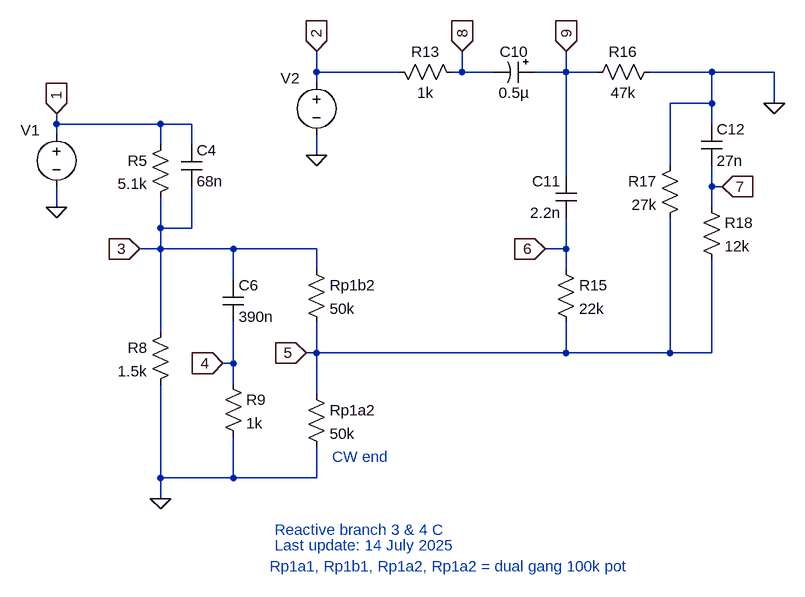
[diagram p0: schematic Reactive_branch_3&4_c.asc]
Reactive_branch_3&4_c.asc, the LTspice schematic file:
Version 4
SHEET 1 4496 5064
WIRE 32 2544 32 2512
WIRE 160 2544 32 2544
WIRE 256 2544 256 2512
WIRE 256 2544 240 2544
WIRE 304 2544 256 2544
WIRE 416 2544 416 2512
WIRE 416 2544 368 2544
WIRE 464 2544 416 2544
WIRE 640 2544 544 2544
WIRE 736 2544 640 2544
WIRE 32 2560 32 2544
WIRE 640 2592 640 2544
WIRE 640 2592 576 2592
WIRE 736 2592 736 2544
WIRE -368 2624 -368 2608
WIRE -208 2624 -368 2624
WIRE -160 2624 -208 2624
WIRE 640 2624 640 2592
WIRE -368 2640 -368 2624
WIRE -208 2656 -208 2624
WIRE -160 2656 -160 2624
WIRE 32 2672 32 2640
WIRE 576 2688 576 2592
WIRE 416 2704 416 2544
WIRE 640 2720 640 2688
WIRE 656 2720 640 2720
WIRE -368 2752 -368 2720
WIRE 640 2752 640 2720
WIRE -208 2784 -208 2736
WIRE -160 2784 -160 2720
WIRE -160 2784 -208 2784
WIRE -208 2816 -208 2784
WIRE -208 2816 -240 2816
WIRE -96 2816 -208 2816
WIRE 32 2816 -96 2816
WIRE 416 2816 416 2768
WIRE 416 2816 384 2816
WIRE 32 2848 32 2816
WIRE 416 2848 416 2816
WIRE -96 2864 -96 2816
WIRE -208 2944 -208 2816
WIRE 32 2976 32 2928
WIRE 32 2976 16 2976
WIRE 416 2976 416 2928
WIRE 416 2976 32 2976
WIRE 576 2976 576 2768
WIRE 576 2976 416 2976
WIRE 640 2976 640 2832
WIRE 640 2976 576 2976
WIRE -96 2992 -96 2928
WIRE -96 2992 -112 2992
WIRE -96 3024 -96 2992
WIRE 32 3040 32 2976
WIRE -208 3168 -208 3024
WIRE -96 3168 -96 3104
WIRE -96 3168 -208 3168
WIRE 32 3168 32 3120
WIRE 32 3168 -96 3168
WIRE -208 3200 -208 3168
FLAG -208 3200 0
FLAG 256 2512 8
IOPIN 256 2512 In
FLAG 416 2512 9
IOPIN 416 2512 In
FLAG 384 2816 6
IOPIN 384 2816 In
FLAG 656 2720 7
IOPIN 656 2720 In
FLAG 16 2976 5
IOPIN 16 2976 In
FLAG -112 2992 4
IOPIN -112 2992 In
FLAG -240 2816 3
IOPIN -240 2816 In
FLAG -368 2608 1
IOPIN -368 2608 In
FLAG -368 2752 0
FLAG 32 2512 2
IOPIN 32 2512 In
FLAG 32 2672 0
FLAG 736 2592 0
SYMBOL res -192 2640 M0
SYMATTR InstName R5
SYMATTR Value 5.1k
SYMBOL res -192 2928 M0
SYMATTR InstName R8
SYMATTR Value 1.5k
SYMBOL cap -176 2656 R0
SYMATTR InstName C4
SYMATTR Value 68n
SYMBOL cap -112 2864 R0
SYMATTR InstName C6
SYMATTR Value 390n
SYMBOL res -112 3008 R0
SYMATTR InstName R9
SYMATTR Value 1k
SYMBOL res 16 2832 R0
SYMATTR InstName Rp1b2
SYMATTR Value 50k
SYMBOL res 16 3024 R0
SYMATTR InstName Rp1a2
SYMATTR Value 50k
SYMBOL res 256 2560 M270
WINDOW 0 32 56 VTop 2
WINDOW 3 0 56 VBottom 2
SYMATTR InstName R13
SYMATTR Value 1k
SYMBOL cap 432 2704 M0
SYMATTR InstName C11
SYMATTR Value 2.2n
SYMBOL res 400 2832 R0
SYMATTR InstName R15
SYMATTR Value 22k
SYMBOL res 592 2672 M0
SYMATTR InstName R17
SYMATTR Value 27k
SYMBOL res 624 2736 R0
SYMATTR InstName R18
SYMATTR Value 12k
SYMBOL cap 624 2624 R0
SYMATTR InstName C12
SYMATTR Value 27n
SYMBOL res 560 2528 R90
WINDOW 0 0 56 VBottom 2
WINDOW 3 32 56 VTop 2
SYMATTR InstName R16
SYMATTR Value 47k
SYMBOL polcap 368 2528 R90
WINDOW 0 0 32 VBottom 2
WINDOW 3 32 32 VTop 2
SYMATTR InstName C10
SYMATTR Value 0.5µ
SYMBOL voltage -368 2624 R0
WINDOW 0 -55 9 Left 2
WINDOW 39 0 0 Left 0
WINDOW 3 -55 37 Invisible 2
WINDOW 123 0 0 Left 0
SYMATTR InstName V1
SYMATTR Value 1
SYMBOL voltage 32 2544 R0
WINDOW 0 -55 9 Left 2
WINDOW 39 0 0 Left 0
WINDOW 3 -493 7 Invisible 2
SYMATTR InstName V2
SYMATTR Value 1
TEXT 56 3136 Left 2 ;CW end
TEXT -40 3304 Left 2 ;Rp1a1, Rp1b1, Rp1a2, Rp1a2 = dual gang 100k pot
TEXT -32 3248 Left 2 ;Reactive branch 3 & 4 C
TEXT -32 3272 Left 2 ;Last update: 14 July 2025

The netlist it stands for:
* Reactive_branch_3&4_c.asc
R5 1 3 5.1k
R8 3 0 1.5k
C4 1 3 68n
C6 3 4 390n
R9 4 0 1k
Rp1b2 3 5 50k
Rp1a2 5 0 50k
R13 8 2 1k
C11 9 6 2.2n
R15 6 5 22k
R17 0 5 27k
R18 7 5 12k
C12 0 7 27n
R16 0 9 47k
C10 9 8 0.5µ
V1 1 0 1
V2 2 0 1
* CW end
* Rp1a1, Rp1b1, Rp1a2, Rp1a2 = dual gang 100k pot
* Reactive branch 3 & 4 C
* Last update: 14 July 2025
.backanno
.end